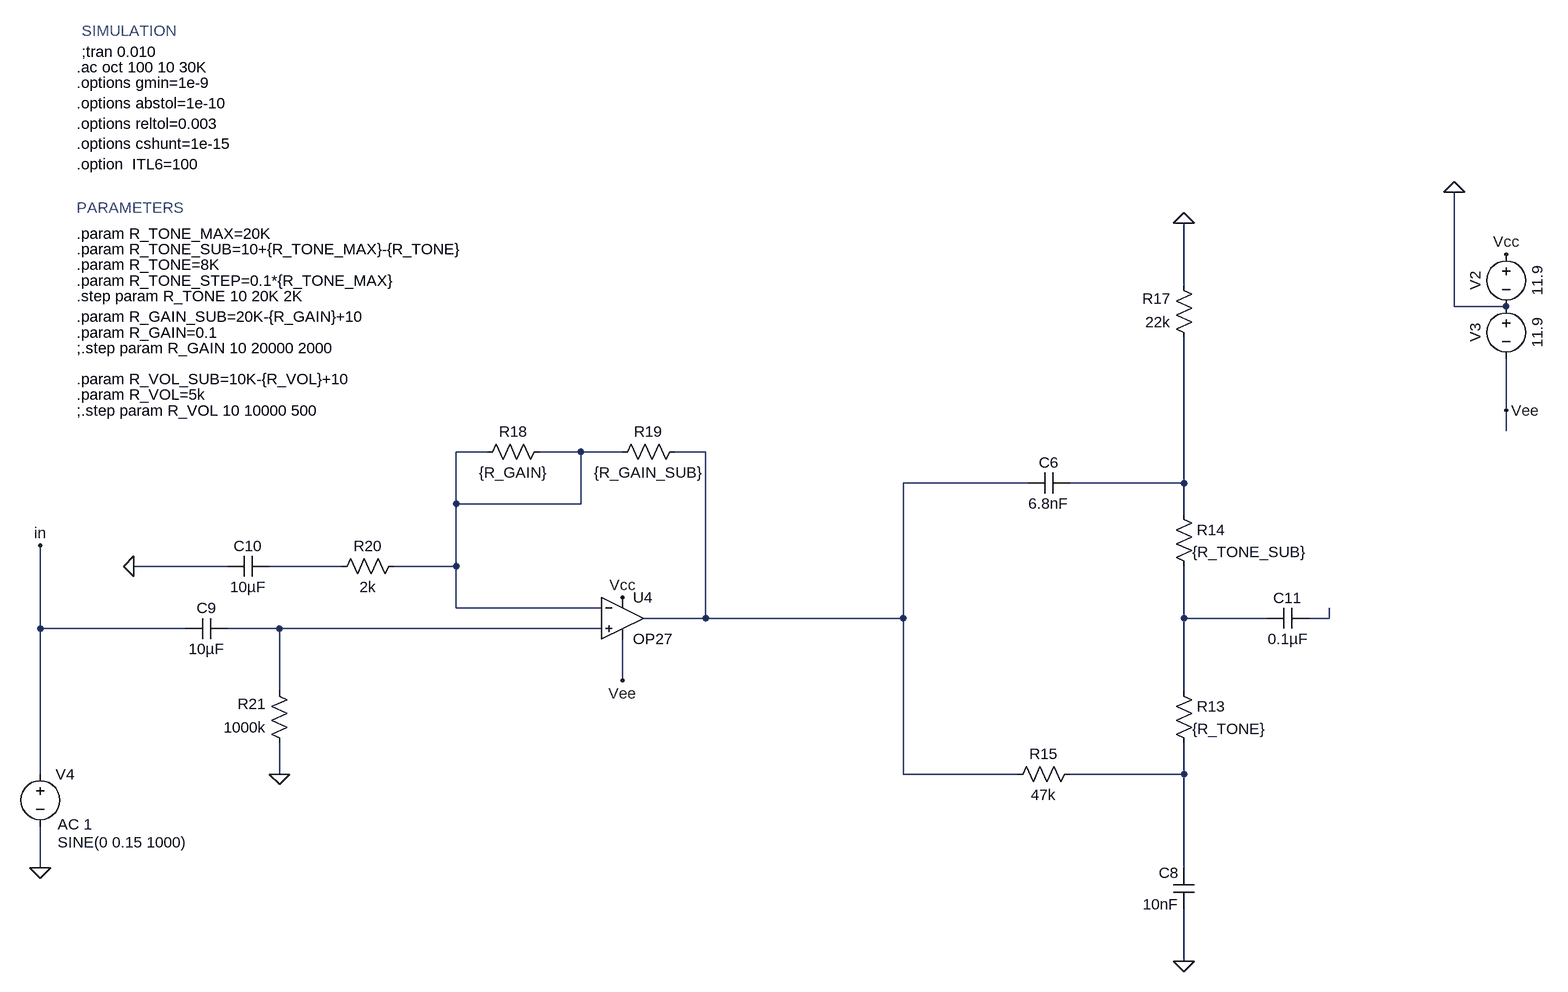
[diagram p0: schematic talkbox.asc]
talkbox.asc, the LTspice schematic file:
Version 4
SHEET 1 1872 1092
WIRE -3184 -336 -3184 -432
WIRE -2768 -304 -2768 -480
WIRE -2688 -304 -2768 -304
WIRE -2688 -144 -2688 -224
WIRE -2688 -112 -2688 -144
WIRE -4256 -80 -4304 -80
WIRE -4112 -80 -4176 -80
WIRE -4048 -80 -4112 -80
WIRE -3920 -80 -3968 -80
WIRE -3424 -32 -3616 -32
WIRE -3184 -32 -3184 -256
WIRE -3184 -32 -3360 -32
WIRE -4304 0 -4304 -80
WIRE -4112 0 -4112 -80
WIRE -4112 0 -4304 0
WIRE -3184 16 -3184 -32
WIRE -4656 96 -4800 96
WIRE -4480 96 -4592 96
WIRE -4304 96 -4304 0
WIRE -4304 96 -4400 96
WIRE -4304 160 -4304 96
WIRE -4080 160 -4304 160
WIRE -3920 176 -3920 -80
WIRE -3920 176 -4016 176
WIRE -3616 176 -3616 -32
WIRE -3616 176 -3920 176
WIRE -3184 176 -3184 96
WIRE -3056 176 -3184 176
WIRE -2960 176 -2960 160
WIRE -2960 176 -2992 176
WIRE -4944 192 -4944 64
WIRE -4720 192 -4944 192
WIRE -4576 192 -4656 192
WIRE -4080 192 -4576 192
WIRE -4048 272 -4048 208
WIRE -4576 288 -4576 192
WIRE -3184 288 -3184 176
WIRE -4944 416 -4944 192
WIRE -4576 416 -4576 368
WIRE -3616 416 -3616 176
WIRE -3440 416 -3616 416
WIRE -3184 416 -3184 368
WIRE -3184 416 -3360 416
WIRE -4944 560 -4944 496
WIRE -3184 560 -3184 416
WIRE -3184 704 -3184 624
FLAG -2768 -480 0
FLAG -2688 -384 Vcc
FLAG -2688 -144 Vee
FLAG -4944 560 0
FLAG -4944 64 in
FLAG -3184 -432 0
FLAG -3184 704 0
FLAG -4048 272 Vee
FLAG -4048 144 Vcc
FLAG -4576 416 0
FLAG -4800 96 0
SYMBOL voltage -2688 -400 R0
WINDOW 0 -32 56 VBottom 2
WINDOW 3 32 56 VTop 2
WINDOW 123 0 0 Left 2
WINDOW 39 60 56 VTop 2
SYMATTR InstName V2
SYMATTR Value 11.9
SYMBOL voltage -2688 -320 R0
WINDOW 0 -32 56 VBottom 2
WINDOW 3 32 56 VTop 2
WINDOW 123 0 0 Left 2
WINDOW 39 0 0 Left 2
SYMATTR InstName V3
SYMATTR Value 11.9
SYMBOL voltage -4944 400 R0
WINDOW 123 27 93 Left 2
WINDOW 39 24 117 Left 2
WINDOW 3 27 121 Left 2
SYMATTR Value2 AC 1
SYMATTR Value SINE(0 0.15 1000)
SYMATTR InstName V4
SYMBOL res -3200 272 R0
WINDOW 3 29 74 Left 2
SYMATTR Value {R_TONE}
SYMATTR InstName R13
SYMBOL res -3200 0 R0
WINDOW 3 29 74 Left 2
SYMATTR Value {R_TONE_SUB}
SYMATTR InstName R14
SYMBOL res -3344 400 R90
WINDOW 0 0 56 VBottom 2
WINDOW 3 32 56 VTop 2
SYMATTR InstName R15
SYMATTR Value 47k
SYMBOL res -3168 -240 R180
WINDOW 0 36 76 Left 2
WINDOW 3 36 40 Left 2
SYMATTR InstName R17
SYMATTR Value 22k
SYMBOL cap -3360 -48 R90
WINDOW 0 0 32 VBottom 2
WINDOW 3 32 32 VTop 2
SYMATTR InstName C6
SYMATTR Value 6.8nF
SYMBOL cap -3168 624 R180
WINDOW 0 24 56 Left 2
WINDOW 3 24 8 Left 2
SYMATTR InstName C8
SYMATTR Value 10nF
SYMBOL res -4160 -96 R90
WINDOW 3 32 56 VTop 2
WINDOW 0 0 56 VBottom 2
SYMATTR Value {R_GAIN}
SYMATTR InstName R18
SYMBOL res -3952 -96 R90
WINDOW 3 32 56 VTop 2
WINDOW 0 0 56 VBottom 2
SYMATTR Value {R_GAIN_SUB}
SYMATTR InstName R19
SYMBOL Opamps\\OP27 -4048 112 R0
SYMATTR InstName U4
SYMBOL res -4384 80 R90
WINDOW 0 0 56 VBottom 2
WINDOW 3 32 56 VTop 2
SYMATTR InstName R20
SYMATTR Value 2k
SYMBOL cap -4656 176 R90
WINDOW 0 0 32 VBottom 2
WINDOW 3 32 32 VTop 2
SYMATTR InstName C9
SYMATTR Value 10µF
SYMBOL res -4560 384 R180
WINDOW 0 36 76 Left 2
WINDOW 3 36 40 Left 2
SYMATTR InstName R21
SYMATTR Value 1000k
SYMBOL cap -4592 80 R90
WINDOW 0 0 32 VBottom 2
WINDOW 3 32 32 VTop 2
SYMATTR InstName C10
SYMATTR Value 10µF
SYMBOL cap -2992 160 R90
WINDOW 0 0 32 VBottom 2
WINDOW 3 32 32 VTop 2
SYMATTR InstName C11
SYMATTR Value 0.1µF
TEXT -4888 -648 Left 2 !.options gmin=1e-9\n.options abstol=1e-10\n.options reltol=0.003\n.options cshunt=1e-15\n.option  ITL6=100
TEXT -4888 -672 Left 2 !.ac oct 100 10 30K
TEXT -4888 -392 Left 2 !.param R_TONE_SUB=10+{R_TONE_MAX}-{R_TONE}
TEXT -4888 -368 Left 2 !.param R_TONE=8K
TEXT -4888 -320 Left 2 !.step param R_TONE 10 20K 2K
TEXT -4888 -264 Left 2 !.param R_GAIN=0.1
TEXT -4888 -288 Left 2 !.param R_GAIN_SUB=20K-{R_GAIN}+10
TEXT -4880 -696 Left 2 !;tran 0.010
TEXT -4888 -240 Left 2 !;.step param R_GAIN 10 20000 2000
TEXT -4888 -456 Left 2 ;PARAMETERS
TEXT -4880 -728 Left 2 ;SIMULATION
TEXT -4888 -168 Left 2 !.param R_VOL=5k
TEXT -4888 -144 Left 2 !;.step param R_VOL 10 10000 500
TEXT -4888 -192 Left 2 !.param R_VOL_SUB=10K-{R_VOL}+10
TEXT -4888 -416 Left 2 !.param R_TONE_MAX=20K
TEXT -4888 -344 Left 2 !.param R_TONE_STEP=0.1*{R_TONE_MAX}

The netlist it stands for:
* talkbox.asc
V2 Vcc 0 11.9
V3 0 Vee 11.9
V4 in 0 SINE(0 0.15 1000) AC 1
R13 N005 N008 {R_TONE}
R14 N003 N005 {R_TONE_SUB}
R15 N008 N002 47k
R17 N003 0 22k
C6 N003 N002 6.8nF
C8 0 N008 10nF
R18 N001 N001 {R_GAIN}
R19 N002 N001 {R_GAIN_SUB}
XU4 N007 N001 Vcc Vee N002 OP27  ; pins In+ In- V+ V- OUT
R20 N001 N004 2k
C9 N007 in 10µF
R21 0 N007 1000k
C10 N004 0 10µF
C11 N006 N005 0.1µF
.options gmin=1e-9
.options abstol=1e-10
.options reltol=0.003
.options cshunt=1e-15
.option  ITL6=100
.ac oct 100 10 30K
.param R_TONE_SUB=10+{R_TONE_MAX}-{R_TONE}
.param R_TONE=8K
.step param R_TONE 10 20K 2K
.param R_GAIN=0.1
.param R_GAIN_SUB=20K-{R_GAIN}+10
;tran 0.010
;.step param R_GAIN 10 20000 2000
* PARAMETERS
* SIMULATION
.param R_VOL=5k
;.step param R_VOL 10 10000 500
.param R_VOL_SUB=10K-{R_VOL}+10
.param R_TONE_MAX=20K
.param R_TONE_STEP=0.1*{R_TONE_MAX}
.lib ADI.lib
.backanno
.end